# EasyEDA Pro project ProProject_myXBoxGamepad_2024-06-05.epro, board PCB1_2
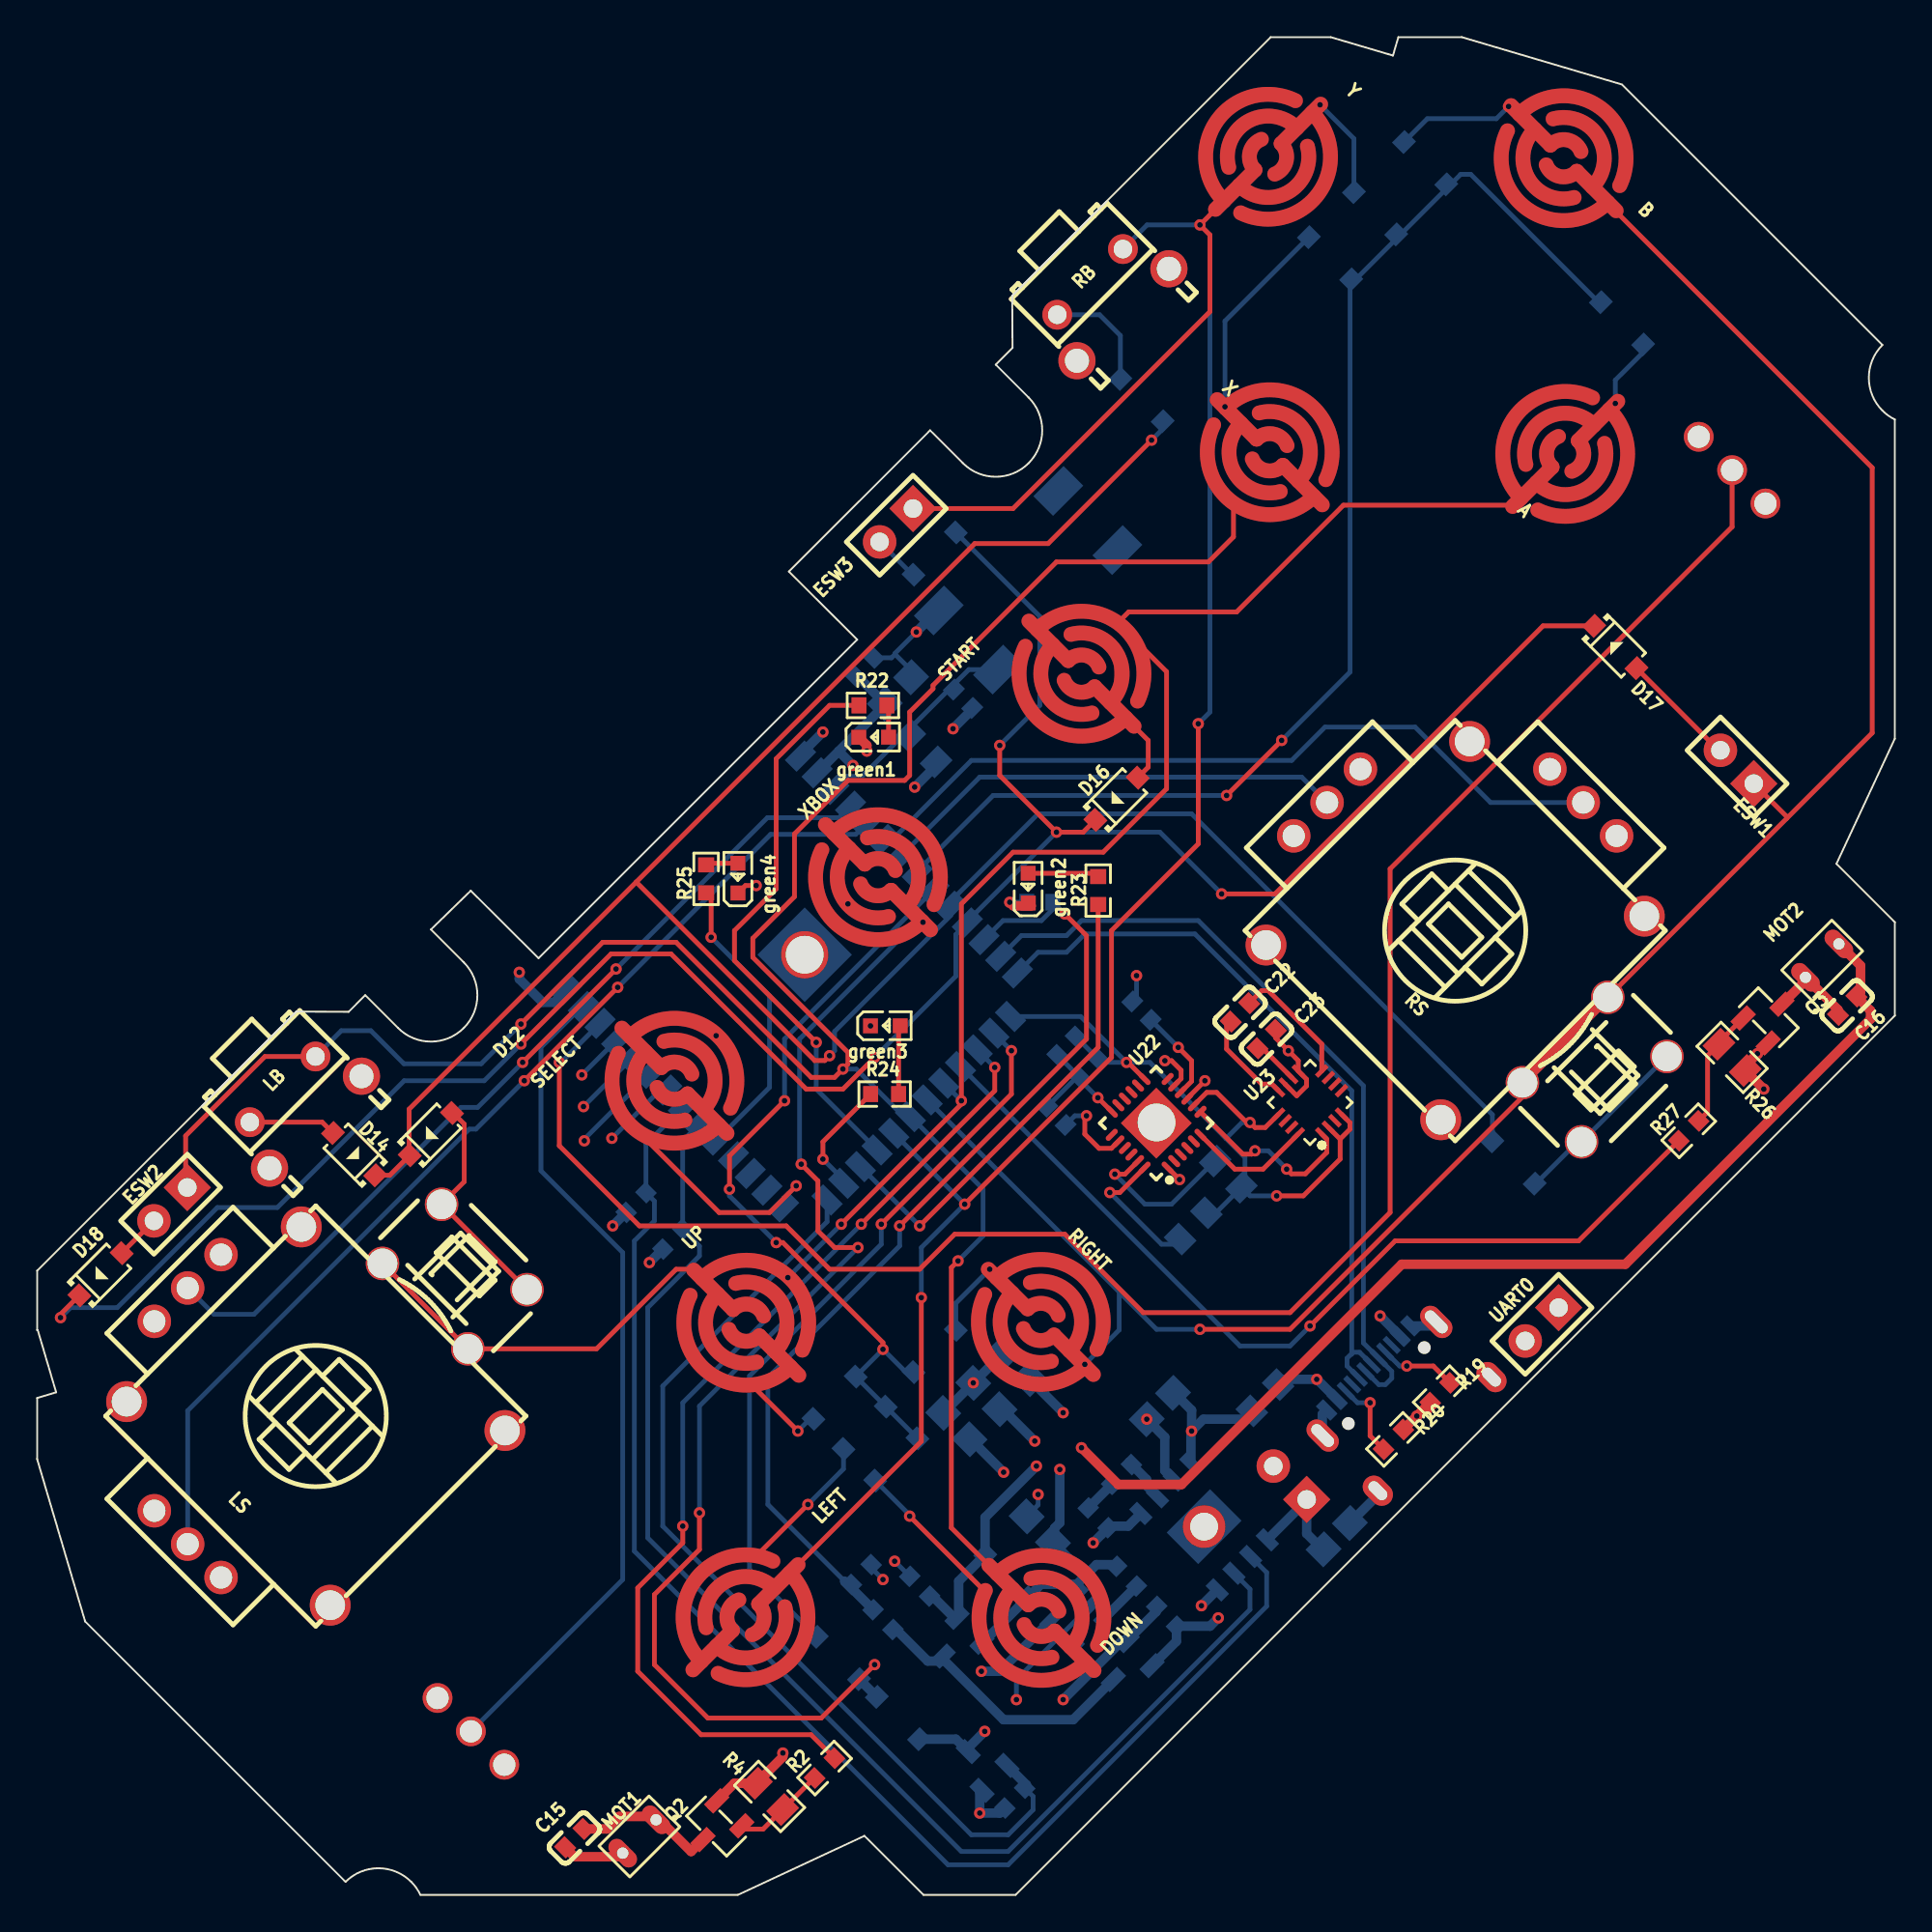
[diagram p3: board, top side]
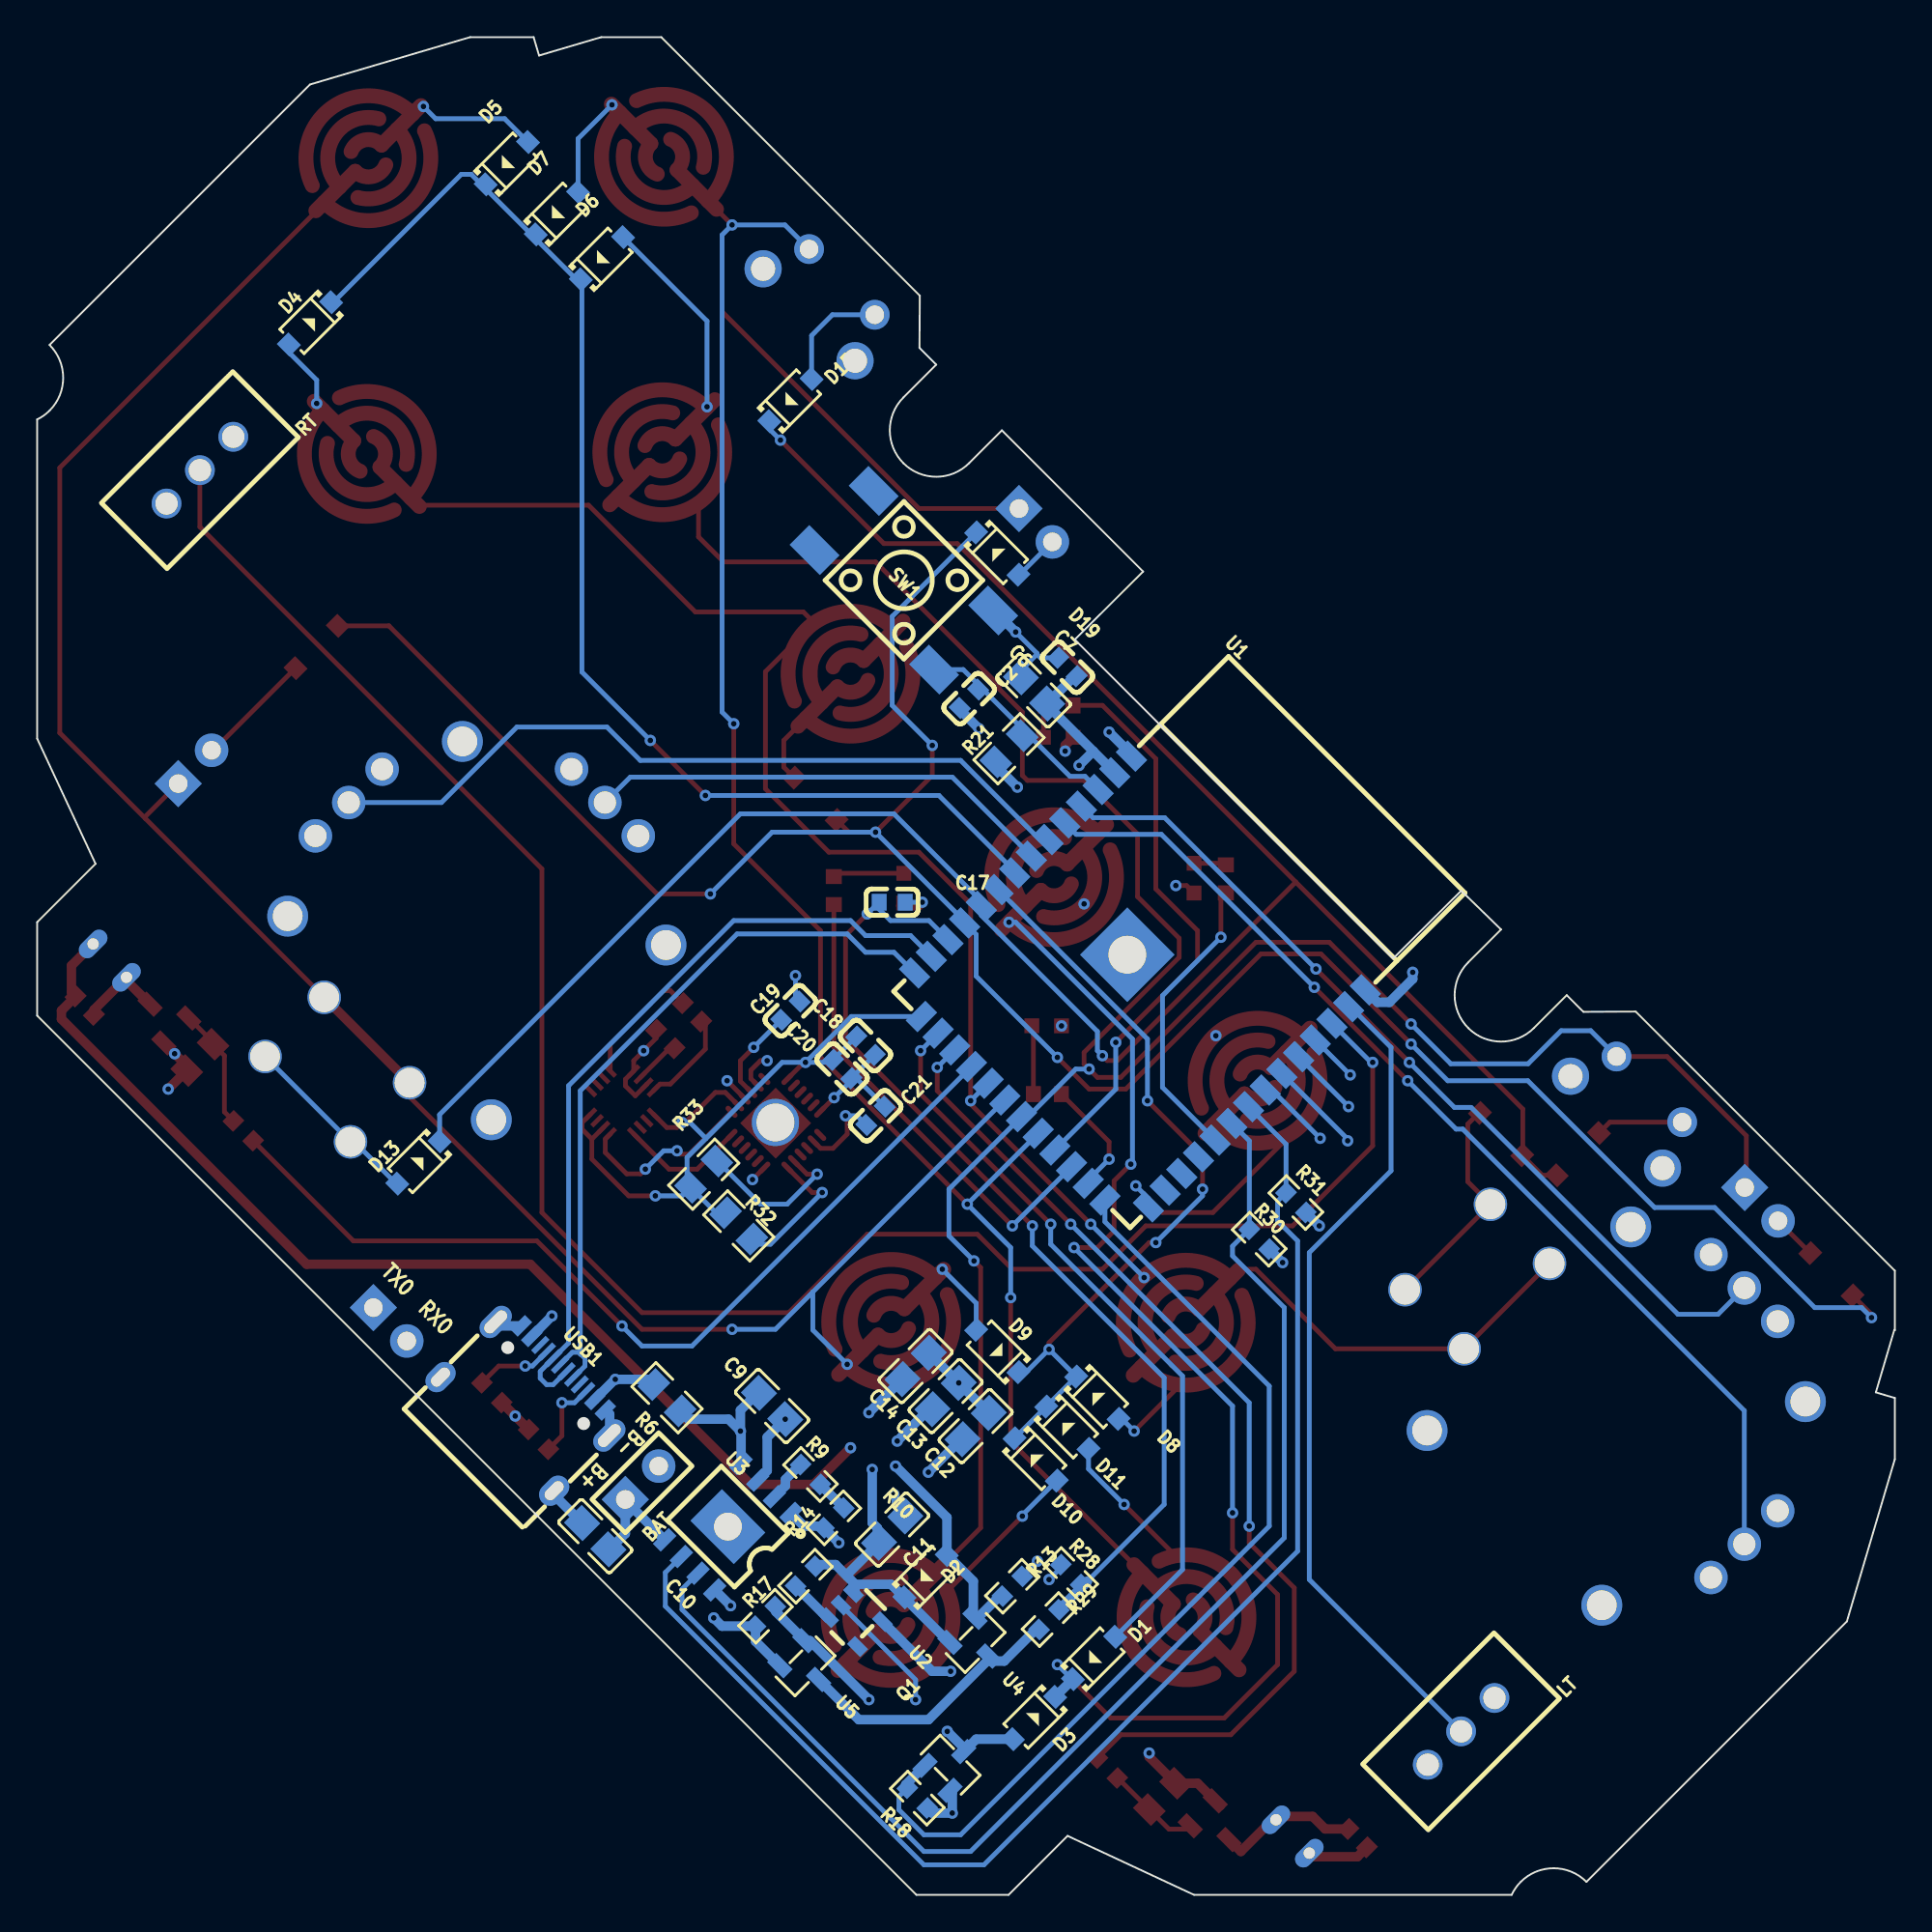
[diagram p4: board, bottom side, seen from below]

Outline 100 x 100 mm; copper layers: Top Layer, 电源层, GND, Bottom Layer. Coordinates in mm from the lower left corner of the outline.
Outline path: 0,33.6 13.95,47.55 16.76,47.53 17.66,48.43 19.43,46.66 arc(21.2,45.93) 22.96,46.66 arc(23.7,48.43) 22.96,50.2 21.2,51.97 23.34,54.05 26.99,50.42 44.14,67.57 40.47,71.23 48.07,78.84 49.83,77.07 arc(51.6,76.34) 53.37,77.07 arc(54.1,78.84) 53.37,80.6 51.6,82.37 52.5,83.28 52.49,86.08 66.4,100 69.63,100 72.98,99.01 73.28,100 76.69,100 85.31,97.45 99.33,83.43 arc(98.6,81.66) 99.33,79.9 arc(99.65,79.63) 100,79.42 100,62.24 96.86,55.5 100,52.36 100,47.33 52.67,0 47.71,0 44.53,3.17 37.72,0 20.63,0 arc(20.41,0.37) 20.14,0.7 arc(18.37,1.43) 16.6,0.7 2.58,14.72 0,23.45 0,26.75 1.02,27.05 0.03,30.41 0,30.4 0,33.6
Stack: Top Layer 0.035mm 外层铜厚1oz / Dielectric1 0.2104mm 7628 RC49% 8.6mil / 电源层 0.0152mm 内层铜厚 / Dielectric2 1.065mm 1.1mm H/HOZ 含铜 / GND 0.0152mm 内层铜厚 / Dielectric3 0.2104mm 7628 RC49% 8.6mil / Bottom Layer 0.035mm 外层铜厚1oz

## Design rules (mm)
template: 自定义配置
spacing copperThickness1oz (default): track to track 0.102, other pairs 0.152 to 0.3
spacing copperThickness2oz: track to track 0.203, other pairs 0.152 to 0.3
track width copperThickness1oz (default): min 0.127, default 0.254, max 2.54
track width copperThickness2oz: min 0.203, default 0.254, max 2.54
differential pair differentialPair (default): width min 0.127, default 0.254, max 2.54; gap min 0.152, default 0.152
via viaSize (default): diameter min 0.5, default 0.61, max 10; hole min 0.3, default 0.305, max 6.299

## Placement (name value [footprint] x y rotation side)
A  key  [导电硅胶按键08]  82.25 77.57 135 top
B  key  [导电硅胶按键08]  82.17 93.48 225 top
BAT  SB2P-HVQ-CA(LF)(SN)  [HDR-TH_2P-P2.54-V-M-1]  67.44 22.18 135 bottom
C2  1uF  [C0603]  49.84 64.39 315 bottom
C6  22uF  [C0805]  46.34 64.84 45 bottom
C7  100nF  [C0603]  44.54 66.09 45 bottom
C9  10uF  [C0805]  60.44 26.31 225 bottom
C10  10uF  [C0805]  69.96 19.31 45 bottom
C11  10uF  [C0805]  53.97 19.67 135 bottom
C12  10uF  [C0805]  49.48 25.23 135 bottom
C13  10uF  [C0805]  51.1 26.85 135 bottom
C14  10uF  [C0805]  52.71 28.47 135 bottom
C15  1uF  [C0603]  28.92 3.05 225 top
C16  1uF  [C0603]  97.44 47.86 45 top
C17  100nF  [C0603]  53.97 53.43 180 bottom
C18  100nF  [C0603]  55.41 45.71 225 bottom
C19  100nF  [C0603]  59.45 47.6 135 bottom
C20  10nF  [C0603]  56.67 44.45 225 bottom
C21  2.2nF  [C0603]  54.87 41.94 315 bottom
C22  0.22uF  [C0603]  64.75 47.51 225 top
C23  0.22uF  [C0603]  66.18 46.07 45 top
D1  1N5819W  [SOD-123_L2.7-W1.6-LS3.7-FD]  43.11 12.75 315 bottom
D2  1N5819W  [SOD-123_L2.7-W1.6-LS3.7-FD]  52.17 17.15 315 bottom
D3  1N5819W  [SOD-123_L2.7-W1.6-LS3.7-FD]  46.34 9.52 135 bottom
D4  1N5819W  [SOD-123_L2.7-W1.6-LS3.7-FD]  85.31 84.59 135 bottom
D5  1N5819W  [SOD-123_L2.7-W1.6-LS3.7-FD]  74.72 93.21 315 bottom
D6  1N5819W  [SOD-123_L2.7-W1.6-LS3.7-FD]  69.6 88.1 315 bottom
D7  1N5819W  [SOD-123_L2.7-W1.6-LS3.7-FD]  72.02 90.52 315 bottom
D8  1N5819W  [SOD-123_L2.7-W1.6-LS3.7-FD]  42.93 26.76 45 bottom
D9  1N5819W  [SOD-123_L2.7-W1.6-LS3.7-FD]  48.31 29.28 225 bottom
D10  1N5819W  [SOD-123_L2.7-W1.6-LS3.7-FD]  46.25 23.44 45 bottom
D11  1N5819W  [SOD-123_L2.7-W1.6-LS3.7-FD]  44.54 25.14 45 bottom
D12  1N5819W  [SOD-123_L2.7-W1.6-LS3.7-FD]  21.19 40.95 225 top
D13  1N5819W  [SOD-123_L2.7-W1.6-LS3.7-FD]  79.47 39.42 135 bottom
D14  1N5819W  [SOD-123_L2.7-W1.6-LS3.7-FD]  17.06 39.87 315 top
D15  1N5819W  [SOD-123_L2.7-W1.6-LS3.7-FD]  59.45 80.46 315 bottom
D16  1N5819W  [SOD-123_L2.7-W1.6-LS3.7-FD]  58.1 59 225 top
D17  1N5819W  [SOD-123_L2.7-W1.6-LS3.7-FD]  84.95 67.17 135 top
D18  1N5819W  [SOD-123_L2.7-W1.6-LS3.7-FD]  3.41 33.41 225 top
D19  1N5819W  [SOD-123_L2.7-W1.6-LS3.7-FD]  48.31 72.2 45 bottom
DOWN  key  [导电硅胶按键08]  54.06 14.91 45 top
ESW1  SB2P-HVQ-CA(LF)(SN)  [HDR-TH_2P-P2.54-V-M-1]  91.51 60.71 135 top
ESW2  SB2P-HVQ-CA(LF)(SN)  [HDR-TH_2P-P2.54-V-M-1]  7.18 37.18 225 top
ESW3  SB2P-HVQ-CA(LF)(SN)  [HDR-TH_2P-P2.54-V-M-1]  46.25 73.73 225 top
green1  -  [LED_0603]  45.08 62.32 0 top
green2  -  [LED_0603]  53.34 54.24 90 top
green3  -  [LED_0603]  45.71 46.79 0 top
green4  -  [LED_0603]  37.72 54.78 90 top
LB  -  [侧插式两脚开关]  14.1 42.48 225 top
LEFT  key  [导电硅胶按键08]  38.13 14.94 315 top
LS  THB001P  [SW-TH_THB001P]  15 25.77 135 top
LT  -  [3*2.54mm]  23.35 8.8 315 bottom
MOT1  -  [VIBRATING-MOTOR-SMD_WELDING]  32.42 3.14 225 top
MOT2  -  [vibrating-motor-smd_welding]  96.09 50.29 45 top
NOREF  -  [Pad_e508]  60.26 41.58 135 top
NOREF#2  -  [Pad_e1298]  41.32 50.61 135 top
NOREF#3  -  [Pad_e154]  62.82 19.82 135 top
Q1  SI2302  [SOT-23-3_L2.9-W1.3-P1.90-LS2.4-BR]  50.83 7 315 bottom
Q2  SI2302  [SOT-23-3_L2.9-W1.3-P1.90-LS2.4-BR]  36.55 3.68 45 top
Q3  SI2302  [SOT-23-3_L2.9-W1.3-P1.90-LS2.4-BR]  93.21 47.24 225 top
R2  2  [R0603]  42.39 6.82 45 top
R4  10K  [R0805]  39.42 5.3 315 top
R6  0.5  [R0805]  66.09 26.76 225 bottom
R9  1K  [R0603]  58.37 22.63 225 bottom
R10  1K  [R0603]  57.11 20.3 315 bottom
R13  100K  [R0603]  47.51 16.61 315 bottom
R14  100K  [R0603]  58.64 17.15 315 bottom
R17  100K  [R0603]  60.8 15 135 bottom
R18  100K  [R0603]  52.62 5.21 225 bottom
R19  5.1K  [R0603]  75.52 27.03 45 top
R20  5.1K  [R0603]  73.01 24.52 225 top
R21  10K  [R0805]  47.68 61.69 135 bottom
R22  5.1K  [R0603]  44.99 64.03 180 top
R23  5.1K  [R0603]  57.11 54.06 270 top
R24  5.1K  [R0603]  45.62 43.11 180 top
R25  5.1K  [R0603]  36.01 54.69 270 top
R26  10K  [R0805]  91.24 45.08 135 top
R27  2  [R0603]  88.9 41.13 45 top
R28  100K  [R0603]  44.36 17.24 225 bottom
R29  100K  [R0603]  45.53 14.82 315 bottom
R30  100K  [R0603]  34.21 35.29 225 bottom
R31  100K  [R0603]  32.24 37.27 225 bottom
R32  10K  [R0805]  62.23 36.01 45 bottom
R33  10K  [R0805]  64.12 38.79 135 bottom
RB  -  [侧插式两脚开关]  57.56 85.94 225 top
RIGHT  key  [导电硅胶按键08]  54.03 30.84 225 top
RS  THB001P  [SW-TH_THB001P]  76.33 51.91 45 top
RT  -  [3*2.54mm]  91.24 76.69 315 bottom
SELECT  BOOT_BTN  [导电硅胶按键08]  34.3 43.82 45 top
START  key  [导电硅胶按键08]  56.22 65.74 45 top
SW1  -  [SW-SMD_4P-L6.0-W6.0-P4.50-LS9.0-2]  53.34 70.76 225 bottom
U1  2.4GHz  [wifim-smd_esp32-s3-wroom-1-n8]  41.13 48.67 225 bottom
U2  TPAP2112K-3.3TRG1  [SOT-23-5_L2.9-W1.6-P0.95-LS2.8-BR]  55.95 14.82 45 bottom
U3  TP4056  [ESOP-8_L4.9-W3.9-P1.27-LS6.0-BL-EP]  62.82 19.82 45 bottom
U4  SI2305  [SOT-23-3_L2.9-W1.3-P1.90-LS2.4-BR]  49.48 13.56 45 bottom
U5  SI2305  [SOT-23-3_L2.9-W1.3-P1.90-LS2.4-BR]  58.64 12.3 45 bottom
U22  MPU-6050  [qfn-24_l4.0-w4.0-p0.50-bl-ep2.7]  60.23 41.53 45 top
U23  QMC5883L  [lga-16_l3.0-w3.0-p0.50-bl_sq]  68.52 42.66 45 top
UART0  SB2P-HVQ-CA(LF)(SN)  [HDR-TH_2P-P2.54-V-M-1]  81 30.71 225 top
UP  key  [导电硅胶按键08]  38.17 30.8 45 top
USB1  TYPE-C 16PIN 2MD(073)  [usb-c-smd_type-c-6pin-2md-073]  73.55 26.49 225 bottom
X  key  [导电硅胶按键08]  66.35 77.66 225 top
XBOX  key  [导电硅胶按键08]  45.26 54.78 45 top
Y  key  [导电硅胶按键08]  66.26 93.56 135 top

## Footprints (pads in the part's own frame, mm; a bottom-side part is the same pattern mirrored in y, then rotated)
3*2.54mm
  round 1.6 hole 1.2: 1(-2.54,0) 2(0,0) 3(2.54,0)
C0603
  rect 0.8x0.9 smd: 1(-0.7,0) 2(0.7,0)
C0805
  rect 1.41x1.35 smd: 1(-1,0) 2(1,0)
ESOP-8_L4.9-W3.9-P1.27-LS6.0-BL-EP
  rect 0.6x1.2 smd: 1(-1.905,-2.909) 2(-0.635,-2.909) 3(0.635,-2.909) 4(1.905,-2.909) 5(1.905,2.909) 6(0.635,2.909) 7(-0.635,2.909) 8(-1.905,2.909)
  rect 3.3x2.4 smd: 9(0,0)
HDR-TH_2P-P2.54-V-M-1
  rect 1.8x1.8 hole 1: 1(-1.27,0)
  round 1.8 hole 1: 2(1.27,0)
LED_0603
  rect 0.8x0.8 smd: 1(-0.851,-0.01) 2(0.75,-0.005)
lga-16_l3.0-w3.0-p0.50-bl_sq
  rect 0.25x0.8 smd: 1(-0.75,-1.644) 2(-0.25,-1.644) 3(0.25,-1.644) 4(0.75,-1.644) 9(0.75,1.644) 10(0.25,1.644) 11(-0.25,1.644) 12(-0.75,1.644)
  rect 0.8x0.25 smd: 5(1.644,-0.75) 6(1.644,-0.25) 7(1.644,0.25) 8(1.644,0.75) 13(-1.644,0.75) 14(-1.644,0.25) 15(-1.644,-0.25) 16(-1.644,-0.75)
Pad_e154
  round 2.286 hole 1.5: 42(0,0)
Pad_e508
  round 2.54 hole 2.032: 42(0,0)
Pad_e1298
  round 2.54 hole 2.032: 42(0,0)
qfn-24_l4.0-w4.0-p0.50-bl-ep2.7
  oval 0.28x0.8 smd: 1(-1.25,-2.127) 2(-0.75,-2.127) 3(-0.25,-2.127) 4(0.25,-2.127) 5(0.75,-2.127) 6(1.25,-2.127) 13(1.25,2.127) 14(0.75,2.127) 15(0.25,2.127) 16(-0.25,2.127) 17(-0.75,2.127) 18(-1.242,2.127)
  oval 0.8x0.28 smd: 7(2.127,-1.25) 8(2.127,-0.75) 9(2.127,-0.25) 10(2.127,0.25) 11(2.127,0.75) 12(2.127,1.25) 19(-2.127,1.25) 20(-2.127,0.75) 21(-2.127,0.25) 22(-2.127,-0.25) 23(-2.127,-0.75) 24(-2.127,-1.25)
  rect 2.7x2.7 smd: 25(0.013,0)
R0603
  rect 0.806x0.864 smd: 1(-0.753,0) 2(0.753,0)
R0805
  rect 1.133x1.377 smd: 1(-1,0) 2(1,0)
SOD-123_L2.7-W1.6-LS3.7-FD
  rect 0.88x0.96 smd: 1(-1.61,0) 2(1.61,0)
SOT-23-3_L2.9-W1.3-P1.90-LS2.4-BR
  rect 1.25x0.7 smd: 1(1,-0.95) 2(1,0.95) 3(-1,0)
SOT-23-5_L2.9-W1.6-P0.95-LS2.8-BR
  rect 1x0.6 smd: 1(1.1,-0.95) 2(1.1,0) 3(1.1,0.95) 4(-1.1,0.95) 5(-1.1,-0.95)
SW-SMD_4P-L6.0-W6.0-P4.50-LS9.0-2
  rect 2.3x1.5 smd: 1(-4.55,2.25) 2(4.55,2.25) 3(-4.55,-2.25) 4(4.55,-2.25)
SW-TH_THB001P
  round 1.8 hole 1.2: 1(9.75,-2.54) 2(9.75,0) 3(9.75,2.54) 4(2.54,9.75) 5(0,9.75) 6(-2.54,9.75)
  round 2.2 hole 1.6: 7(-7.75,6.65) 8(-7.75,-6.65) 9(7.75,-6.65) 10(7.75,6.65)
  round 1.8 hole 1.6x1.2: a(-3.23,-8.35) b(3.27,-8.35) c(-3.23,-12.85) d(3.27,-12.85)
usb-c-smd_type-c-6pin-2md-073
  rect 0.55x1.1 smd: 1(-3.2,2.648) 2(-2.4,2.646) 11(2.4,2.646) 12(3.2,2.646)
  rect 0.3x1.1 smd: 3(-1.75,2.646) 4(-1.25,2.646) 5(-0.75,2.646) 6(-0.25,2.646) 7(0.25,2.646) 8(0.75,2.646) 9(1.25,2.646) 10(1.75,2.646)
  oval 1.2x1.8 hole 0.6x1.2: 13(-4.325,-2.375) 14(4.325,-2.375)
  oval 1.1x2 hole 0.6x1.5: 13(-4.325,1.825) 14(4.325,1.825)
VIBRATING-MOTOR-SMD_WELDING
  oval 0.9x1.8 hole 0.61: 1(-1.27,0) 2(1.27,0)
vibrating-motor-smd_welding
  oval 0.9x1.8 hole 0.61: 1(-1.27,0) 2(1.27,0)
wifim-smd_esp32-s3-wroom-1-n8
  rect 1.5x0.9 smd: 1(-8.9,8.954) 2(-8.9,7.684) 3(-8.9,6.415) 4(-8.9,5.144) 5(-8.9,3.874) 6(-8.9,2.604) 7(-8.9,1.335) 8(-8.9,0.065) 9(-8.9,-1.206) 10(-8.9,-2.475) 11(-8.9,-3.745) 12(-8.9,-5.016) 13(-8.9,-6.285) 14(-8.9,-7.556) 27(8.9,-7.556) 28(8.9,-6.285) 29(8.9,-5.016) 30(8.9,-3.745) 31(8.9,-2.475) 32(8.9,-1.206) 33(8.9,0.065) 34(8.9,1.335) 35(8.9,2.604) 36(8.9,3.874) 37(8.9,5.144) 38(8.9,6.415) 39(8.9,7.684) 40(8.9,8.954)
  rect 0.9x1.5 smd: 15(-6.985,-8.954) 16(-5.715,-8.954) 17(-4.445,-8.954) 18(-3.175,-8.954) 19(-1.905,-8.954) 20(-0.635,-8.954) 21(0.635,-8.954) 22(1.905,-8.954) 23(3.175,-8.954) 24(4.445,-8.954) 25(5.715,-8.954) 26(6.985,-8.954)
  rect 3.6x3.6 smd: 41(-1.5,1.235)
侧插式两脚开关
  round 1.6 hole 1: 1(-2.5,-1.25) 2(2.5,-1.25)
  round 2 hole 1.3: NC(-3.5,1.25) NC(3.5,1.25)
导电硅胶按键08
  custom 2.99x4.886 smd: 1(-2.115,0.568)
  custom 0.8x3.8 smd: 1(0,2.5) 2(0,-2.5)
  custom 1.805x2.213 smd: 1(0.843,0.547)
  custom 4.16x7.338 smd: 1(3.314,0.554) 2(-3.314,-0.553)
  custom 1.8x2.206 smd: 2(-0.839,-0.545)
  custom 2.991x4.887 smd: 2(2.116,-0.569)

## Nets
3.3V: C6.1 C7.1 C12.1 C13.1 C14.1 LS.3 LS.6 LT.1 R21.1 R30.2 R31.2 RS.3 RS.6 RT.1 U1.2 U2.5
GND: BAT.2 C2.2 C6.2 C7.2 C9.2 C10.2 C11.2 C12.2 C13.2 C14.2 C17.2 C18.2 C19.2 C20.2 C21.1 C23.2 green1.1 green2.1 green3.1 green4.1 LS.1 LS.4 LT.3 NOREF.42 NOREF#2.42 NOREF#3.42 Q1.2 Q2.2 Q3.2 R4.1 R10.2 R13.1 R18.2 R19.1 R20.1 R26.1 R28.1 RS.1 RS.4 RT.3 SELECT.1 SW1.2 U1.1 U1.40 U1.41 U2.2 U3.1 U3.3 U3.9 U22.1 U22.9 U22.11 U22.18 U22.25 U23.9 U23.11 USB1.1 USB1.12 USB1.13 USB1.14 XBOX.1
VBAT: BAT.1 C10.1 R17.1 U3.5 U5.2
VBAT_1: R29.2 U4.3 U5.3
A_1: A.1 LS.a LS.b START.1 U1.19 UP.1
A_2: A.2 D4.1
B_1: B.1 ESW1.1 RIGHT.1 RS.a RS.b U1.20
B_2: B.2 D5.1
BOOT: SELECT.2 U1.27
D+: U1.14 USB1.6 USB1.8
D-: U1.13 USB1.5 USB1.7
DOWN_1: DOWN.1 ESW2.1 LB.1 U1.21 X.1
DOWN_2: D10.1 DOWN.2
GPIO1: LT.2 U1.39
GPIO2: RT.2 U1.38
GPIO3: C18.1 C20.1 R32.2 R33.1 U1.15 U22.8 U22.13 U23.2 U23.4 U23.13
GPIO4: LS.2 U1.4
GPIO5: LS.5 U1.5
GPIO6: RS.2 U1.6
GPIO7: RS.5 U1.7
GPIO8: C17.1 R28.2 R29.1 U1.12
GPIO9: R2.2 U1.17
GPIO10: R27.1 U1.18
GPIO14: ESW3.1 LEFT.1 RB.1 U1.22 Y.1
GPIO15: D4.2 D5.2 D6.2 D7.2 U1.8
GPIO16: D8.2 D9.2 D10.2 D11.2 U1.9
GPIO17: D12.2 D13.2 D14.2 D15.2 U1.10
GPIO18: D16.2 D17.2 D18.2 D19.2 U1.11
GPIO21: R22.2 U1.23
GPIO38: R25.2 U1.31
GPIO39: R30.1 U1.32 U3.7
GPIO40: R31.1 U1.33 U3.6
GPIO45: Q1.1 R18.1 U1.26
GPIO46: D1.1 U1.16
GPIO47: R23.2 U1.24
GPIO48: R24.2 U1.25
LB_2: D14.1 LB.2
LEFT_2: D11.1 LEFT.2
LS_2: D12.1 LS.c LS.d
MISO: U1.30
MOSI: U1.28
RB_2: D15.1 RB.2
RESET: C2.1 R21.2 SW1.4 U1.3
RIGHT_2: D9.1 RIGHT.2
RS_2: D13.1 RS.c RS.d
RXD0: U1.36 UART0.2
SCK: U1.29
SCL: R33.2 U1.34 U22.23
SDA: R32.1 U1.35 U22.24
START_2: D16.1 START.2
TXD0: U1.37 UART0.1
UP_2: D8.1 UP.2
VUSB: D2.1 R6.1 R13.2 U4.1 USB1.2 USB1.11
VUSB_OR_VBAT: C11.1 C15.2 C16.2 D2.2 MOT1.2 MOT2.2 R14.1 U2.1 U4.2
X_2: D6.1 X.2
XSCL: U22.7 U23.1
XSDA: U22.6 U23.16
Y_2: D7.1 Y.2
$1N1324: R9.2 R10.1
$1N1328: R9.1 U3.2
$1N2751: R14.2 U2.3
$1N3780: D3.1 Q1.3 R17.2 U5.1
$1N3912: D1.2 D3.2 XBOX.2
$1N8434: R19.2 USB1.4
$1N8460: R20.2 USB1.10
$1N17335: green1.2 R22.1
$1N17361: green2.2 R23.1
$1N17387: green3.2 R24.1
$1N17413: green4.2 R25.1
$1N18714: C15.1 MOT1.1 Q2.3
$1N18779: Q2.1 R2.1 R4.2
$1N18990: C16.1 MOT2.1 Q3.3
$1N18998: Q3.1 R26.2 R27.2
$1N25608: D17.1 ESW1.2
$1N25630: D18.1 ESW2.2
$1N25649: D19.1 ESW3.2
$1N28110: C9.1 R6.2 U3.4 U3.8
$1N35263: C19.1 U22.10
$1N35470: C21.2 U22.20
$1N35689: C22.1 U23.8
$1N35693: C22.2 U23.12
$1N35727: C23.1 U23.10

Pads without a net: LB NC; LS 7 8 9 10; RB NC; RS 7 8 9 10; SW1 1 3; U2 4; U22 2 3 4 5 12 14 15 16 17 19 21 22; U23 3 5 6 7 14 15; USB1 3 9

## Via types
v1: diameter 0.61, hole 0.305, Top Layer to Bottom Layer, 118 vias

## Routing (per net, layer and track width the routed paths; a pad name or vN(x,y) marks a point on that pad's centre or on a via; arc(x,y) is an arc through that point)
3.3V: length 235.3
  电源层 w0.508: 60.62,47.15 61.33,47.15 64.39,44.09 64.39,38.7 61.42,35.74 61.42,32.15 v1(55.23,25.95) v1(53.7,24.43) v1(52.03,22.75) 50.02,20.74 50.02,19.04 ; 60.62,47.15 57.56,47.15 46.05,58.66 ; 60.62,47.15 60.62,52.89 66.18,58.46 ; v1(50.83,12.03) 50.02,12.84 50.02,19.04 ; 77.93,64.1 89.44,75.61 89.44,78.49 ; 77.93,64.1 77.86,64.03 71.75,64.03 66.18,58.46 ; 77.93,64.1 RS.3 ; 7.99,15.18 LS.6 ; 7.99,15.18 2.24,20.92 2.24,26.85 6.27,30.87 LS.3 ; 7.99,15.18 12.57,10.6 LT.1 26.04,15.09 32.33,15.09 36.28,19.04 ; 36.28,19.04 50.02,19.04 ; 36.28,19.04 36.37,19.13 36.37,30.62 v1(32.96,34.04) v1(30.98,36.01) ; 46.05,58.66 46.27,58.66 v1(47.24,59.63) ; 46.05,58.66 v1(43.91,60.8) ; RS.6 66.18,58.46
  Bottom Layer w0.508: U2.5 51.82,12.03 v1(50.83,12.03) ; v1(52.03,22.75) 50.25,24.53 C12.1 ; 51.8,26.14 51.98,26.14 v1(53.7,24.43) ; C7.1 44.16,65.6 C6.1 45.63,64.04 43.15,61.56 ; R21.1 48.39,60.78 v1(47.24,59.63) ; 43.15,61.56 U1.2 ; 43.15,61.56 v1(43.91,60.8) ; v1(32.96,34.04) 33.68,34.76 ; v1(55.23,25.95) C14.1 ; v1(30.98,36.01) R31.2
GND: length 76.3
  Top Layer w0.254: U22.11 61.58,43.94 61.58,44.39 61.07,44.9 v1(60.71,44.9) ; 67.18,43.64 67.18,43.64 67.8,43.02 68.33,43.55 68.33,43.9 U23.9 67.89,44.9 v1(67.35,45.44) 66.68,46.11 66.68,46.56 ; U22.1 v1(61.49,38.5) ; green4.1 38.13,54.33 v1(38.7,54.33) ; U22.9 61.92,42.88 v1(62.86,43.82) ; U22.18 v1(57.1,42.91)
  Top Layer w0.508: v1(52.36,53.43) 52.55,53.24 53.5,53.24 green2.1 ; v1(44.66,61.57) 44.66,61.88 green1.1 ; 36.32,4.79 37.53,6.01 R4.1 40.14,7.43 v1(40.14,7.63) ; R19.1 v1(74.27,25.77) R20.1 ; v1(92.95,43.37) R26.1 91.95,44.62 v1(92.6,45.28) Q3.2
  Bottom Layer w0.254: 46.18,66.78 45.99,66.59 C7.2 ; 46.18,66.78 47.05,65.92 C6.2 ; 46.18,66.78 46.18,66.83 v1(47.33,67.98) ; C20.2 55.9,43.96 C21.1 ; C20.2 C18.2 ; C20.2 56.17,43.84 v1(57.1,42.91) 57.02,42.84 ; v1(45.53,16.97) 44.89,17.61 R28.1 ; v1(52.36,53.43) 53.27,53.43 ; U2.2 52.71,11.58 v1(52.71,10.51) ; R13.1 v1(46.16,17.96) ; v1(59.18,49.48) 59.18,48.32 C19.2 ; 53.26,20.37 53.88,20.99 v1(53.88,21.55)
  Bottom Layer w0.508: USB1.12 69.18,25.86 69.18,24.74 ; C10.2 72.2,21.55 72.2,21.73 ; USB1.1 75.1,30.63 USB1.13 ; 52.09,4.68 51.82,4.4 v1(50.74,4.4) 50.74,5.5 50.86,5.63 ; 41.09,61.3 41.09,61.39 v1(42.3,62.59) ; C12.2 v1(50.39,27.56) C14.2 ; 57.56,19.66 57.56,19.67 ; 57.56,19.66 57.74,19.85 58.73,19.85 U3.1 ; 57.56,19.66 v1(56.84,18.95) ; v1(25.95,49.66) 25.95,49.3 27.21,48.04 27.84,48.04 28.5,48.71 ; v1(47.33,67.98) 48.48,69.14 48.53,69.14 ; U3.3 60.7,22.83 60.7,24.63 v1(59.73,25.6) ; v1(49.3,62.77) 50.34,63.81 50.34,63.89
  vias: v1(36.55,46.25) v1(43.64,53.34) v1(44.86,46.78)
VBAT: length 18.9
  电源层 w0.508: 68.12,21.01 68.21,19.54 v1(63.58,14.91)
  Bottom Layer w0.508: U5.2 61.33,13.65 R17.1 63.14,14.46 v1(63.58,14.91) ; BAT.1 68.34,19.44 69.23,18.55 ; 68.12,21.01 66.22,19.11
VBAT_1: length 14.8
  Bottom Layer w0.508: R29.2 46.24,14.28 47.94,12.58 48.86,12.58 52.02,9.43 55.77,9.43 57.93,11.6
A_1: length 95.5
  Top Layer w0.254: v1(43.28,36.1) 49.75,42.57 v1(49.75,42.75) 49.75,53.34 52.53,56.13 57.38,56.13 60.8,59.54 60.8,65.84 START.1 58.76,69.06 64.57,69.06 70.32,74.81 79.44,74.81 80.93,76.29 ; 18.59,33.99 LS.a 30.11,29.39 34.39,33.68 35.29,33.68 35.43,33.53
  Bottom Layer w0.254: v1(40.41,33.23) v1(43.28,36.1) ; v1(49.75,42.75) U1.19
A_2: length 3.8
  Bottom Layer w0.254: D4.1 86.45,83.04 84.95,81.54 v1(84.95,80.28)
B_1: length 112.3
  Top Layer w0.254: 94.17,57.94 98.78,62.55 98.78,76.82 83.94,91.67 B.1 ; 94.17,57.94 94.17,58.05 ESW1.1 ; 94.17,57.94 RS.b ; RS.a 79.95,42.95 67.44,30.44 v1(62.59,30.44)
  Top Layer w0.508: RS.b RS.a
  Bottom Layer w0.254: 58.25,32.45 58.25,30.41 v1(56.4,28.56) ; 58.25,32.45 60.26,30.44 v1(62.59,30.44) ; 58.25,32.45 47.91,42.79
B_2: length 6.4
  Bottom Layer w0.254: D5.1 74.83,95.61 78.55,95.61 v1(79.21,96.27)
BOOT: length 12.3
  Top Layer w0.254: SELECT.2 36.71,36.73 39.42,36.73 v1(40.86,38.17)
  Bottom Layer w0.254: U1.27 40.18,37.48 v1(40.86,38.17)
D+: length 39.7
  Bottom Layer w0.254: 71.16,27.82 70.51,28.47 70.51,28.89 70.83,29.21 71.19,29.21 71.87,28.53 ; 70.76,29.1 70.76,43.28 62.32,51.73 56.4,51.73 55.41,50.74 53.88,50.74 52.77,49.62
D-: length 42.2
  Bottom Layer w0.254: 71.51,28.17 72.22,27.47 72.57,27.47 72.92,27.81 72.92,28.18 72.22,28.88 ; U1.13 52.98,51.64 55.41,51.64 56.22,52.44 62.5,52.44 71.39,43.55 71.39,29.71 72.21,28.89
DOWN_1: length 130.7
  Top Layer w0.254: ESW2.1 7.99,38.17 7.99,40.86 12.26,45.13 LB.1 ; v1(26.04,46.88) 30.44,51.28 34.39,51.28 41.67,44 42.93,44 v1(43.37,44.45) 43.64,44.72 43.64,45.35 38.52,50.47 38.52,51.49 40.77,53.73 40.77,57.11 43.64,59.99 46.7,59.99 46.97,60.26 46.97,63.67 48.22,64.93 48.22,65.11 54.87,71.75 63.05,71.75 64.4,73.1 64.4,74.92 ; DOWN.1 49.21,19.76 49.21,33.77 v1(49.57,34.12)
  Bottom Layer w0.254: LB.1 16.37,46.52 17.96,46.52 19.74,44.74 23.9,44.74 v1(26.04,46.88) ; v1(49.57,34.12) 50.92,35.47 50.92,37.99 U1.21 46.65,41.89 44.09,44.45 v1(43.37,44.45)
DOWN_2: length 8.5
  Top Layer w0.254: 50.31,17.04 50.83,16.52 50.83,16.16 ; v1(46.97,20.39) 50.29,17.06
  Bottom Layer w0.254: 45.11,22.3 46.97,20.44 v1(46.97,20.39)
GPIO1: length 45.2
  Bottom Layer w0.254: U1.39 29.31,47.81 27.12,45.62 27.12,38.97 31.52,34.57 31.52,16.97 LT.2
GPIO2: length 107.4
  Top Layer w0.254: RT.2 91.24,73.64 72.83,55.23 72.83,36.73 67.44,31.34 59.54,31.34 55.32,35.56 49.39,35.56 47.51,33.68 42.66,33.68 40.32,36.01 32.42,36.01 28.11,40.32 v1(28.11,44.81)
  Bottom Layer w0.254: 30.3,46.92 28.2,44.81 v1(28.11,44.81)
GPIO3: length 42.3
  Top Layer w0.254: 70.14,40.68 70.14,39.61 68.16,37.63 v1(66.72,37.63) ; 70.14,40.68 U23.2 ; 70.14,40.68 70.14,40.69 70.67,41.21 70.67,41.57 U23.4 ; U22.13 58.72,44.81 v1(58.64,44.81) ; U22.8 62.96,43.19 63.49,43.19 65.11,41.58 v1(65.29,41.58) 65.56,41.31 66.11,41.31 U23.13
  Bottom Layer w0.254: C18.1 C20.1 57.3,44.81 v1(58.64,44.81) ; 64.83,38.09 65.02,38.09 65.02,39.69 64,40.71 ; 64.83,38.09 65.29,37.63 v1(66.72,37.63) ; 64.83,38.09 63.46,36.72 62.94,36.72 ; v1(58.64,44.81) 56.17,47.28 U1.15 ; v1(58.64,44.81) 59.9,44.81 64,40.71 ; 64,40.71 64.86,41.58 v1(65.29,41.58)
GPIO4: length 47.6
  Top Layer w0.254: v1(26.13,44.81) v1(31.16,49.84)
  Bottom Layer w0.254: v1(31.16,49.84) 39.3,57.98 43.16,57.98 43.78,58.6 ; 8.1,32.67 9.52,31.25 11.67,31.25 22.81,42.39 23.71,42.39 v1(26.13,44.81)
GPIO5: length 56.9
  Top Layer w0.254: v1(31.25,48.85) v1(26.22,43.82)
  Bottom Layer w0.254: U1.5 44.06,57.09 39.48,57.09 v1(31.25,48.85) ; v1(26.22,43.82) 23.62,41.22 23.26,41.22 8.1,26.06 LS.5
GPIO6: length 41.8
  Bottom Layer w0.254: 45.58,56.81 46.03,56.81 50.29,61.07 67.53,61.07 69.33,62.86 74.18,62.86 78.24,58.8 RS.2
GPIO7: length 25.3
  Bottom Layer w0.254: RS.5 68.07,60.17 50.74,60.17 U1.7
GPIO8: length 53.1
  Top Layer w0.254: v1(46.43,36.01) 56.49,46.07 56.49,51.64 v1(55.32,52.8)
  Bottom Layer w0.254: v1(46.43,36.01) 46.43,34.93 39.33,27.84 39.33,21.01 43.46,16.89 ; 50.97,51.42 51.99,52.44 54.06,52.44 54.67,53.05 C17.1 54.69,53.43 v1(55.32,52.8)
  Bottom Layer w0.508: R29.1 43.46,16.89
GPIO9: length 54.3
  Top Layer w0.254: v1(51.55,44.54) 51.55,43.28 v1(44.36,36.1) ; 42.92,7.37 42.92,7.36 41.66,8.62 35.74,8.62 32.33,12.03 32.33,16.52 34.75,18.95 v1(34.75,19.85)
  Bottom Layer w0.254: v1(51.55,44.54) U1.17 ; v1(44.36,36.1) 34.75,26.49 v1(34.75,19.85)
GPIO10: length 49.5
  Top Layer w0.254: v1(68.52,30.62) 73.1,35.2 82.98,35.2 R27.1
  Bottom Layer w0.254: v1(68.52,30.62) 67.44,29.54 64.75,29.54 49.71,44.59
GPIO14: length 119.5
  Top Layer w0.254: 63.28,90.76 63.28,90.58 v1(62.59,89.89) 63.13,89.35 63.13,85.22 52.53,74.63 47.15,74.63 ; LEFT.1 47.6,24.41 v1(47.6,32.15) ; v1(62.5,63.04) 62.5,56.58 57.83,51.91 57.83,45.08 v1(49.93,37.18)
  Bottom Layer w0.254: v1(47.6,32.15) 47.6,34.84 v1(49.93,37.18) 46.11,40.99 ; 58.45,88.59 59.75,89.89 v1(62.59,89.89) 63.13,89.35 63.13,63.67 v1(62.5,63.04)
GPIO15: length 67.5
  Top Layer w0.254: v1(66.99,62.14) v1(64.03,59.18)
  Bottom Layer w0.254: v1(64.03,59.18) 51.46,59.18 47.38,55.1 47.38,55.01 ; v1(66.99,62.14) 70.67,65.83 70.67,86.66 76.63,92.62 77.17,92.62 84.05,85.73 D4.2
GPIO16: length 41.9
  Top Layer w0.254: v1(45.53,29.37) 45.53,29.72 40.14,35.11 v1(39.78,35.11) ; v1(40.23,42.75) 37.27,39.78 v1(37.27,37.99)
  Bottom Layer w0.254: v1(37.27,37.99) 37.27,37.63 v1(39.78,35.11) ; v1(40.23,42.75) 40.23,46.07 U1.9 ; D9.2 46.76,28.14 v1(45.53,29.37) 44.06,27.9 D11.2 D10.2
GPIO17: length 126
  Top Layer w0.254: 32.25,54.52 50.47,72.74 54.42,72.74 v1(59.99,78.31) ; 32.25,54.52 20.03,42.3 20.03,39.78 ; 32.25,54.52 41.86,44.91 42.4,44.91 v1(42.66,45.17) ; 20.03,39.78 D12.2 ; 20.03,39.78 18.98,38.73 18.02,38.73 17.96,38.79
  Bottom Layer w0.254: 60.59,79.32 60.59,78.91 v1(59.99,78.31) ; D13.2 78.34,42 62.14,58.19 53.88,58.19 49.17,53.48 49.17,52.72 42.93,46.48 42.93,45.44 v1(42.66,45.17)
GPIO18: length 132.3
  Top Layer w0.254: v1(26.04,45.8) 30.89,50.65 34.12,50.65 41.4,43.37 43.37,43.37 v1(45.08,45.08) ; v1(51.82,61.87) 51.82,60.26 v1(54.87,57.2) 56.31,57.2 56.96,57.86 ; D17.2 81.06,68.31 66.63,53.88 v1(63.76,53.88) ; D18.2 1.26,31.25 v1(1.26,31.07)
  Bottom Layer w0.254: 49.45,73.34 53.97,68.82 53.97,64.03 v1(51.82,61.87) ; v1(45.08,45.08) 49.45,49.45 49.45,51.7 U1.11 50.07,52.41 v1(54.87,57.2) 60.44,57.2 v1(63.76,53.88) ; v1(1.26,31.07) 1.8,31.61 4.31,31.61 9.7,37 12.93,37 19.76,43.82 24.07,43.82 v1(26.04,45.8)
GPIO21: length 30.8
  Top Layer w0.254: R22.2 42.66,64.03 39.78,61.16 39.78,54.15 37.54,51.91 37.54,50.29 v1(41.94,45.89)
  Bottom Layer w0.254: v1(41.94,45.89) 41.94,43.37 U1.23
GPIO38: length 15.9
  Top Layer w0.254: R25.2 36.28,53.67 v1(36.28,51.55)
  Bottom Layer w0.254: U1.31 39.42,43.47 39.42,48.4 v1(36.28,51.55)
GPIO39: length 71.3
  Bottom Layer w0.254: 64.42,17.32 65.29,16.45 65.29,15.36 52.27,2.33 49.75,2.33 32.87,19.22 32.87,31.61 35.65,34.39 35.65,34.92 34.75,35.83 34.75,40.59 U1.32
GPIO40: length 75.2
  Bottom Layer w0.254: U3.6 66.18,17.35 66.18,15.54 52.27,1.62 49.03,1.62 32.15,18.5 32.15,35.2 33.23,36.28 33.23,37.35 R31.1 32.77,40.41 U1.33
GPIO45: length 51.6
  Bottom Layer w0.254: 42.52,37.4 42.52,36.24 33.68,27.39 33.68,19.85 50.29,3.23 52.27,3.23 53.61,4.58 53.61,5.3 53.25,5.66 53.25,5.83
  Bottom Layer w0.508: Q1.1 53.25,5.93 53.25,5.83
GPIO46: length 40.2
  Top Layer w0.254: v1(45.44,36.1) 52.44,43.11 v1(52.44,45.44)
  Bottom Layer w0.254: v1(45.44,36.1) 45.44,35.02 38.35,27.93 38.35,17.51 D1.1 ; v1(52.44,45.44) U1.16
GPIO47: length 25.8
  Top Layer w0.254: v1(47.51,36.01) 57.11,45.62 57.11,53.31
  Bottom Layer w0.254: v1(47.51,36.01) 44.32,39.2
GPIO48: length 6.3
  Top Layer w0.254: R24.2 42.3,40.54 v1(42.3,39.6)
  Bottom Layer w0.254: U1.25 43.42,38.48 v1(42.3,39.6)
LB_2: length 4.7
  Top Layer w0.254: 11.45,41.59 15.34,41.59 D14.1
LEFT_2: length 7.7
  Top Layer w0.254: 38.72,18.25 v1(41.49,21.01)
  Bottom Layer w0.254: D11.1 43.4,22.93 v1(41.49,21.01)
LS_2: length 12.1
  Top Layer w0.254: 26.37,32.58 LS.d 22.99,38.39 22.99,41.49 22.45,42.03
RB_2: length 6.2
  Bottom Layer w0.254: RB.2 57.19,85.06 58.31,83.94 D15.1
RESET: length 11.5
  Bottom Layer w0.254: U1.3 43.6,60.21 44.41,60.21 50.15,65.96 SW1.4
RIGHT_2: length 6.1
  Top Layer w0.254: 52.73,32.19 52.73,32.23 v1(51.28,33.68)
  Bottom Layer w0.254: D9.1 49.45,31.85 v1(51.28,33.68)
RS_2: length 9.8
  Bottom Layer w0.254: 87.73,45.13 83.13,40.54 82.92,40.54 80.76,38.37
RXD0: length 150.9
  电源层 w0.254: v1(29.41,42.43) 33.41,46.43 33.41,54.96 62.06,83.61 88.67,83.61 97.35,74.93 97.35,68.21 95.37,66.24 95.37,56.9 90.88,52.41 90.88,41.67 83.97,34.75 82.53,34.75 79.56,31.79 79.56,30.35 UART0.2
  Bottom Layer w0.254: 32.1,45.12 v1(29.41,42.43)
SCL: length 41.8
  Top Layer w0.254: U22.23 58.56,38.79 v1(58.01,38.79)
  电源层 w0.254: v1(58.01,38.79) 55.41,41.4 40.68,41.4 39.24,39.96 31.7,39.96 v1(30.94,40.73)
  Bottom Layer w0.254: v1(58.01,38.79) 59.63,37.18 61.07,37.18 63.23,39.34 63.23,39.68 ; 33.89,43.32 33.53,43.32 v1(30.94,40.73)
SDA: length 43.3
  Top Layer w0.254: v1(57.74,37.81) 58.28,37.81 U22.24
  电源层 w0.254: v1(57.74,37.81) 54.96,40.59 40.95,40.59 39.51,39.15 30.89,39.15 v1(29.45,40.59)
  Bottom Layer w0.254: v1(57.74,37.81) 60.53,35.02 61.6,35.02 61.71,35.12 ; v1(29.45,40.59) 29.45,40.68 U1.35
START_2: length 7.6
  Top Layer w0.254: D16.1 59.81,60.71 59.81,62.14 58.11,63.84 START.2
TXD0: length 146.4
  电源层 w0.254: v1(29.32,44.14) 32.6,47.42 32.6,55.05 61.78,84.23 88.9,84.23 97.97,75.16 97.97,67.8 96.09,65.91 96.09,56.76 91.51,52.18 91.51,41.4 81.9,31.79 UART0.1
  Bottom Layer w0.254: U1.37 v1(29.32,44.14)
UP_2: length 4.8
  Top Layer w0.254: v1(40.95,24.97) 38.61,27.3 38.61,27.7
  Bottom Layer w0.254: D8.1 41.61,25.62 v1(40.95,24.97)
VUSB: length 40
  电源层 w0.508: v1(72.29,31.16) v1(68.88,27.75) 67.8,28.83 59.54,28.83 v1(53.79,23.08)
  Bottom Layer w0.508: 66.74,27.74 66.76,27.75 v1(68.88,27.75) ; USB1.11 68.95,27.7 ; 73.37,30.06 v1(72.29,31.16) ; R13.2 48.04,16.24 49.43,14.85 49.61,15.03 49.61,16.88 51.03,18.3 51.03,20.31 v1(53.79,23.08)
VUSB_OR_VBAT: length 117.7
  Top Layer w0.508: 28.42,2.56 28.93,2.05 31.33,2.05 31.61,2.33 ; v1(56.22,24.07) 58.19,22.09 61.6,22.09 73.46,33.95 85.49,33.95 98.69,47.15 98.69,47.6 97.93,48.36 98.15,48.58 98.15,50.02 MOT2.2
  电源层 w0.508: v1(56.22,24.07) v1(55.05,22.9) 55.05,14.64 50.65,10.24 46.34,10.24 37.36,1.26 33.95,1.26 32.96,2.24 MOT1.2
  Bottom Layer w0.508: 56.39,17.14 56.39,17.25 54.77,18.87 54.77,19.75 55.05,20.03 v1(55.05,22.9) ; 56.39,17.14 57.02,17.77 58.02,17.77 R14.1 ; 56.39,17.14 55.96,16.72 ; 55.96,16.72 55.96,16.18 U2.1 ; 55.96,16.72 54.04,16.72 50.92,13.6 U4.2
X_2: length 11
  Bottom Layer w0.254: D6.1 63.94,84.72 v1(63.94,80.1)
XSCL: length 9.9
  Top Layer w0.254: 69.14,40.95 69.42,40.68 69.42,39.96 68.27,38.81 67.52,38.81 v1(67.26,39.06) ; v1(65.56,40.05) 65.38,39.87 64.9,39.87 U22.7
  Bottom Layer w0.254: v1(65.56,40.05) 66.27,40.05 v1(67.26,39.06)
XSDA: length 6.8
  Top Layer w0.254: 67.89,40.96 65.99,39.06 64.47,39.06 U22.6
Y_2: length 5.5
  Bottom Layer w0.254: v1(69.06,96.36) 70.88,94.53 D7.1
$1N1324: length 1.7
  Bottom Layer w0.508: 56.49,20.74 57.65,21.89 57.7,21.89
$1N1328: length 2.5
  Bottom Layer w0.508: 58.78,23.3 59.72,22.36 59.72,22.02 60.31,21.43
$1N2751: length 2.5
  Bottom Layer w0.508: 57.4,14.92 57.44,14.88 59.17,16.62
$1N3780: length 16.6
  电源层 w0.508: v1(51.01,8.8) 51.64,9.43 54.15,9.43 v1(55.23,10.51)
  Bottom Layer w0.508: D3.1 49.45,8.38 Q1.3 50.11,7.72 50.11,7.9 v1(51.01,8.8) ; 60.23,15.56 60.23,15.24 U5.1 58.4,13.68 v1(55.23,10.51)
$1N3912: length 66.2
  Top Layer w0.254: v1(41.13,39.33) 42.03,38.44 42.03,35.74 42.93,34.84 v1(44.18,34.84) ; v1(35.65,20.56) 35.65,18.59 33.23,16.16 33.23,12.39 36.1,9.52 42.21,9.52 v1(45.08,12.39)
  Bottom Layer w0.254: v1(44.18,34.84) 35.65,26.31 v1(35.65,20.56) ; v1(47.68,52.35) 47.33,52.35 41.04,46.07 41.04,39.42 v1(41.13,39.33) ; v1(45.08,12.39) 44.3,11.61 44.24,11.61
  Bottom Layer w0.508: D3.2 44.24,11.61
$1N8434: length 3.9
  Top Layer w0.254: v1(73.73,28.47) 75.15,28.47 R19.2
  Bottom Layer w0.254: v1(73.73,28.47) 73.34,28.47 72.75,29.05
$1N8460: length 4.4
  Top Layer w0.254: R20.2 71.75,24.71 v1(71.75,26.49)
  Bottom Layer w0.254: USB1.10 71.07,26.49 v1(71.75,26.49)
$1N17335: length 1.7
  Top Layer w0.254: 45.83,62.32 45.83,63.9 45.74,63.98
$1N17361: length 3.8
  Top Layer w0.254: 53.35,54.99 56.94,54.99 R23.1
$1N17387: length 3.7
  Top Layer w0.254: R24.1 46.37,46.7 46.46,46.78
$1N17413: length 1.7
  Top Layer w0.254: green4.2 36.1,55.53 R25.1
$1N18714: length 7.5
  Top Layer w0.508: 35.66,2.8 35.2,2.33 33.32,4.22 31.34,4.22 30.67,3.55 29.41,3.55
$1N18779: length 5.3
  Top Layer w0.254: 37.75,3.54 39.08,3.54 R4.2 41.83,6.29 41.86,6.29 R2.1
$1N18990: length 4.7
  Top Layer w0.508: 96.94,47.37 96.94,47.64 MOT2.1 95.19,49.21 Q3.3
$1N18998: length 6.1
  Top Layer w0.254: 90.44,45.34 90.44,45.81 91.57,46.93 ; 90.17,45.43 89.92,45.17 89.92,42.14 R27.2
$1N25608: length 6.4
  Top Layer w0.254: 86.09,66.03 90.51,61.61 ESW1.2
$1N25630: length 2.5
  Top Layer w0.254: ESW2.2 D18.1
$1N25649: length 2.6
  Bottom Layer w0.254: ESW3.2 47.17,71 D19.1
$1N28110: length 20.9
  电源层 w0.508: v1(62.14,24.97) 61.63,24.46 61.63,22.75 59.54,20.66 59.54,18.7 v1(62.67,15.56)
  Bottom Layer w0.508: 61.16,27.07 62.14,26.09 v1(62.14,24.97) ; v1(62.14,24.97) 62.11,24.93 62.11,23.22 ; v1(62.14,24.97) 62.78,25.6 64.94,25.6 65.39,26.05 ; U3.8 v1(62.67,15.56)
$1N35263: length 5
  Top Layer w0.254: 61.56,43.21 62.14,43.79 62.14,44.9 v1(61.42,45.62)
  Bottom Layer w0.254: v1(61.42,45.62) C19.1
$1N35470: length 4.6
  Top Layer w0.254: v1(56.49,41.94) 56.4,41.85 56.4,40.95 57.16,40.18 57.83,40.18 U22.20
  Bottom Layer w0.254: v1(56.49,41.94) 55.86,41.94 C21.2
$1N35689: length 6.8
  Top Layer w0.254: C22.1 65.92,48.67 66.27,48.67 69.15,45.8 U23.8
$1N35693: length 5.3
  Top Layer w0.254: U23.12 66.47,43.64 65.92,43.64 64.03,45.53 64.03,46.79 C22.2
$1N35727: length 2.5
  Top Layer w0.254: 67.53,44 65.95,45.57 65.69,45.57

## Copper pours and planes (outline as drawn; the poured copper is in the pictures)
GND on 电源层: -15.09,23.89 75.52,114.5 126.53,63.49 35.92,-27.12
GND on GND: -16.61,23.44 73.37,113.42 123.39,63.4 33.41,-26.58

## Text on the board
Bottom Silkscreen Layer: RX0 | TX0 | B- | B+
